# Altium schematic sheet Functionality Diagram.SchDoc
size A; SheetNumber: 2; SheetTotal: 2
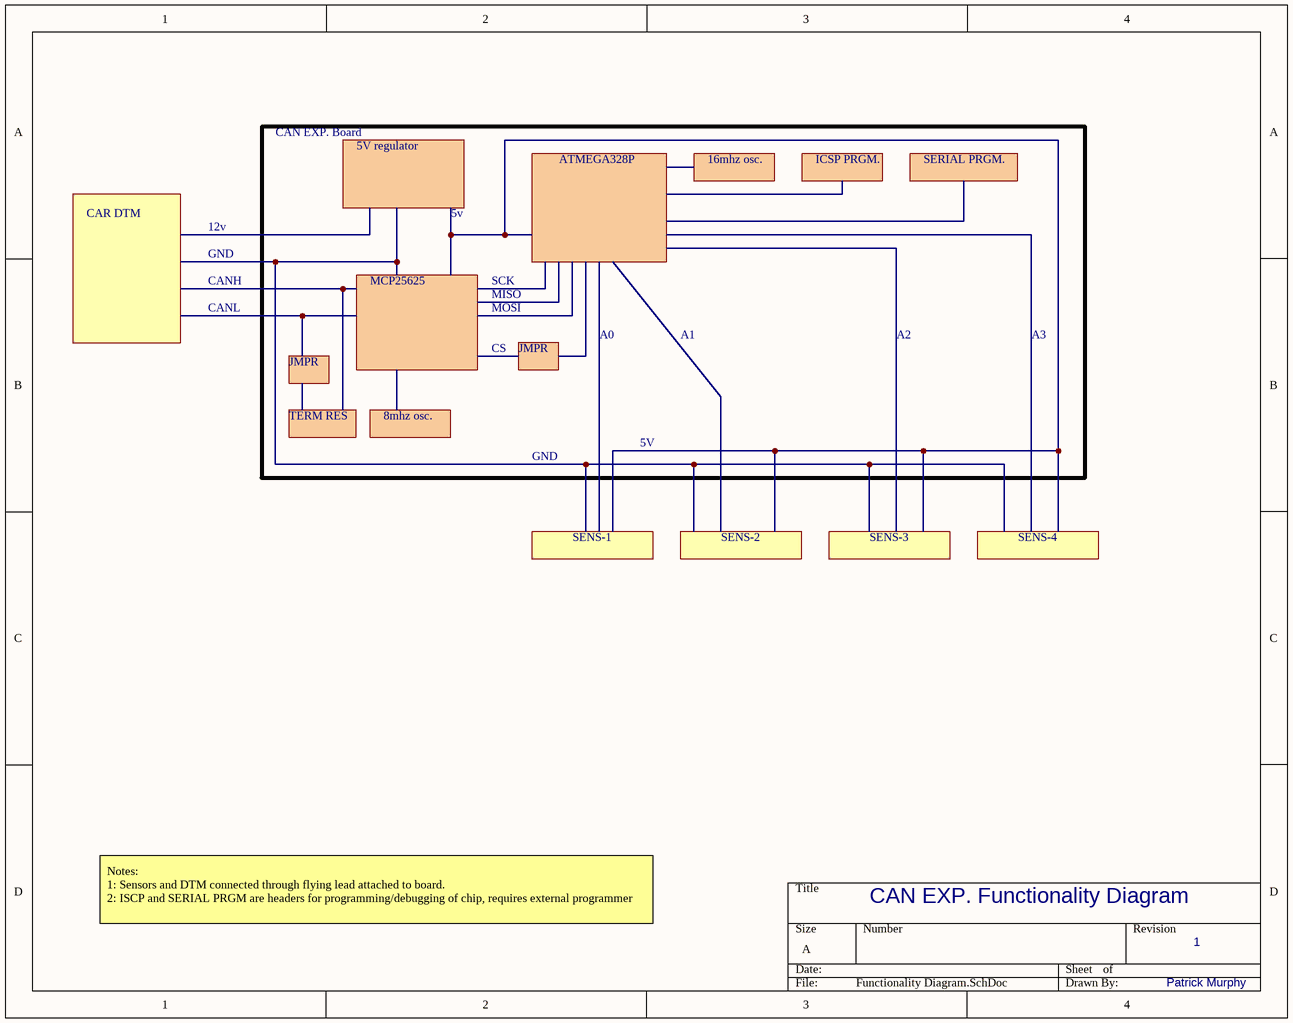
[diagram p0: Functionality Diagram.SchDoc]

## Notes on the sheet
- CAN EXP. Board
- 5V regulator
- ATMEGA328P
- 16mhz osc.
- ICSP PRGM.
- SERIAL PRGM.
- CAR DTM
- 12v
- 5v
- GND
- CANH
- MCP25625
- SCK
- MISO
- CANL
- JMPR
- MOSI
- CS
- A0
- A1
- A2
- A3
- TERM RES
- 8mhz osc.
- 5V
- SENS-1
- SENS-2
- SENS-3
- SENS-4
- CAN EXP. Functionality Diagram
- Notes:
  1: Sensors and DTM connected through flying lead attached to board.
  2: ISCP and SERIAL PRGM are headers for programming/debugging of chip, requires external programmer
- 1
- Patrick Murphy